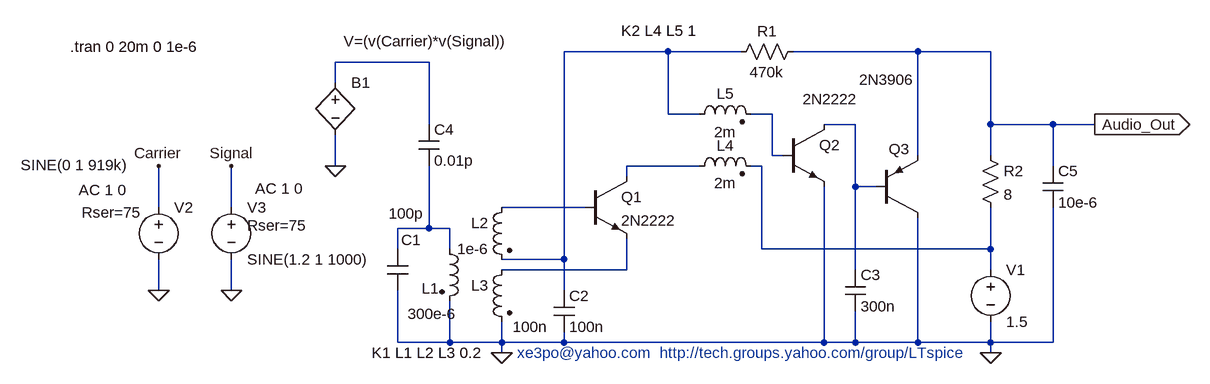
[diagram p0: schematic AM_3transistor_radio_xe3po_done.asc]
AM_3transistor_radio_xe3po_done.asc, the LTspice schematic file:
Version 4
SHEET 1 1132 680
WIRE 96 -80 -64 -80
WIRE 208 -80 96 -80
WIRE 480 -80 288 -80
WIRE 592 -80 480 -80
WIRE -272 -64 -416 -64
WIRE -416 -32 -416 -64
WIRE 96 16 96 -80
WIRE 144 16 96 16
WIRE 256 16 224 16
WIRE -272 32 -272 -64
WIRE 384 32 336 32
WIRE 592 32 592 -80
WIRE 688 32 592 32
WIRE 752 32 688 32
WIRE 256 80 256 16
WIRE 272 80 256 80
WIRE 480 80 480 -80
WIRE 592 80 592 32
WIRE -416 96 -416 48
WIRE 144 96 32 96
WIRE 240 96 224 96
WIRE 688 96 688 32
WIRE 32 112 32 96
WIRE 384 128 384 32
WIRE 416 128 384 128
WIRE -688 160 -688 96
WIRE -576 160 -576 96
WIRE -32 160 -160 160
WIRE -272 192 -272 96
WIRE -272 192 -320 192
WIRE -240 192 -272 192
WIRE -320 224 -320 192
WIRE -240 224 -240 192
WIRE 240 224 240 96
WIRE 592 224 592 160
WIRE 592 224 240 224
WIRE -64 240 -64 -80
WIRE -64 240 -160 240
WIRE 32 256 32 208
WIRE 32 256 -160 256
WIRE 384 256 384 128
WIRE 592 256 592 224
WIRE -688 288 -688 240
WIRE -576 288 -576 240
WIRE -64 288 -64 240
WIRE -320 368 -320 288
WIRE -240 368 -240 304
WIRE -240 368 -320 368
WIRE -160 368 -160 336
WIRE -160 368 -240 368
WIRE -64 368 -64 352
WIRE -64 368 -160 368
WIRE 336 368 336 128
WIRE 336 368 -64 368
WIRE 384 368 384 320
WIRE 384 368 336 368
WIRE 480 368 480 176
WIRE 480 368 384 368
WIRE 592 368 592 336
WIRE 592 368 480 368
WIRE 688 368 688 160
WIRE 688 368 592 368
WIRE -160 384 -160 368
WIRE 592 384 592 368
FLAG 592 384 0
FLAG -160 384 0
FLAG -416 96 0
FLAG -688 288 0
FLAG -576 288 0
FLAG -688 96 Carrier
FLAG -576 96 Signal
FLAG 752 32 Audio_Out
IOPIN 752 32 Out
SYMBOL ind2 -256 208 R0
WINDOW 0 -27 77 Left 2
WINDOW 3 -49 116 Left 2
SYMATTR InstName L1
SYMATTR Value 300e-6
SYMATTR Type ind
SYMATTR SpiceLine Rser=0.1
SYMBOL ind2 -144 144 M0
SYMATTR InstName L2
SYMATTR Value 1e-6
SYMATTR Type ind
SYMATTR SpiceLine Rser=10m
SYMBOL ind2 -144 240 M0
WINDOW 3 -55 104 Left 2
SYMATTR Value 100n
SYMATTR InstName L3
SYMATTR Type ind
SYMATTR SpiceLine Rser=10m
SYMBOL npn -32 112 R0
SYMATTR InstName Q1
SYMATTR Value 2N2222
SYMBOL voltage 592 240 R0
WINDOW 123 0 0 Left 2
WINDOW 39 0 0 Left 2
SYMATTR InstName V1
SYMATTR Value 1.5
SYMBOL ind2 128 112 R270
WINDOW 0 32 56 VTop 2
WINDOW 3 5 56 VBottom 2
SYMATTR InstName L4
SYMATTR Value 2m
SYMATTR Type ind
SYMATTR SpiceLine Rser=20
SYMBOL ind2 128 32 R270
WINDOW 0 32 56 VTop 2
WINDOW 3 4 56 VBottom 2
SYMATTR InstName L5
SYMATTR Value 2m
SYMATTR Type ind
SYMATTR SpiceLine Rser=20
SYMBOL cap -336 224 R0
WINDOW 0 21 -14 Left 2
WINDOW 3 2 -55 Left 2
SYMATTR InstName C1
SYMATTR Value 100p
SYMATTR SpiceLine Rser=100m
SYMBOL cap -80 288 R0
SYMATTR InstName C2
SYMATTR Value 100n
SYMBOL res 192 -64 R270
WINDOW 0 32 56 VTop 2
WINDOW 3 0 56 VBottom 2
SYMATTR InstName R1
SYMATTR Value 470k
SYMBOL npn 272 32 R0
WINDOW 3 31 -39 Left 2
SYMATTR Value 2N2222
SYMATTR InstName Q2
SYMBOL pnp 416 176 M180
WINDOW 3 -26 213 Left 2
WINDOW 0 19 106 Left 2
SYMATTR Value 2N3906
SYMATTR InstName Q3
SYMBOL cap 368 256 R0
SYMATTR InstName C3
SYMATTR Value 300n
SYMBOL res 576 64 R0
SYMATTR InstName R2
SYMATTR Value 8
SYMBOL cap -288 32 R0
SYMATTR InstName C4
SYMATTR Value 0.01p
SYMBOL voltage -688 144 R0
WINDOW 3 -212 -49 Left 2
WINDOW 123 -123 -11 Left 2
WINDOW 39 -118 24 Left 2
SYMATTR Value SINE(0 1 919k)
SYMATTR Value2 AC 1 0
SYMATTR SpiceLine Rser=75
SYMATTR InstName V2
SYMBOL voltage -576 144 R0
WINDOW 123 37 -13 Left 2
WINDOW 39 24 44 Left 2
SYMATTR Value2 AC 1 0
SYMATTR SpiceLine Rser=75
SYMATTR InstName V3
SYMATTR Value SINE(1.2 1 1000)
SYMBOL bv -416 -48 R0
WINDOW 3 13 -48 Left 2
SYMATTR Value V=(v(Carrier)*v(Signal))
SYMATTR InstName B1
SYMBOL cap 672 96 R0
SYMATTR InstName C5
SYMATTR Value 10e-6
TEXT -360 384 Left 2 !K1 L1 L2 L3 0.2
TEXT 24 -112 Left 2 !K2 L4 L5 1
TEXT -824 -88 Left 2 !.tran 0 20m 0 1e-6
TEXT -136 384 Left 2 ;xe3po@yahoo.com  http://tech.groups.yahoo.com/group/LTspice

The netlist it stands for:
* AM_3transistor_radio_xe3po_done.asc
L1 N008 0 300e-6 Rser=0.1
L2 N007 N001 1e-6 Rser=10m
L3 N009 0 100n Rser=10m
Q1 N005 N007 N009 0 2N2222
V1 N006 0 1.5
L4 N005 N006 2m Rser=20
L5 N001 N003 2m Rser=20
C1 N008 0 100p Rser=100m
C2 N001 0 100n
R1 N001 Audio_Out 470k
Q2 N004 N003 0 0 2N2222
Q3 0 N004 Audio_Out 0 2N3906
C3 N004 0 300n
R2 Audio_Out N006 8
C4 N002 N008 0.01p
V2 Carrier 0 SINE(0 1 919k) AC 1 0 Rser=75
V3 Signal 0 SINE(1.2 1 1000) AC 1 0 Rser=75
B1 N002 0 V=(v(Carrier)*v(Signal))
C5 Audio_Out 0 10e-6
.model NPN NPN
.model PNP PNP
.lib standard.bjt
K1 L1 L2 L3 0.2
K2 L4 L5 1
.tran 0 20m 0 1e-6
* xe3po@yahoo.com  http://tech.groups.yahoo.com/group/LTspice
.backanno
.end